# Altium schematic sheet WC_SENS.SchDoc
size A; Organization: Altium Limited; Address1: L3, 12a Rodborough Rd; Address2: Frenchs Forest; Address3: NSW; Address4: Australia 2086; DocumentNumber: 10; SheetNumber: 10; SheetTotal: 11
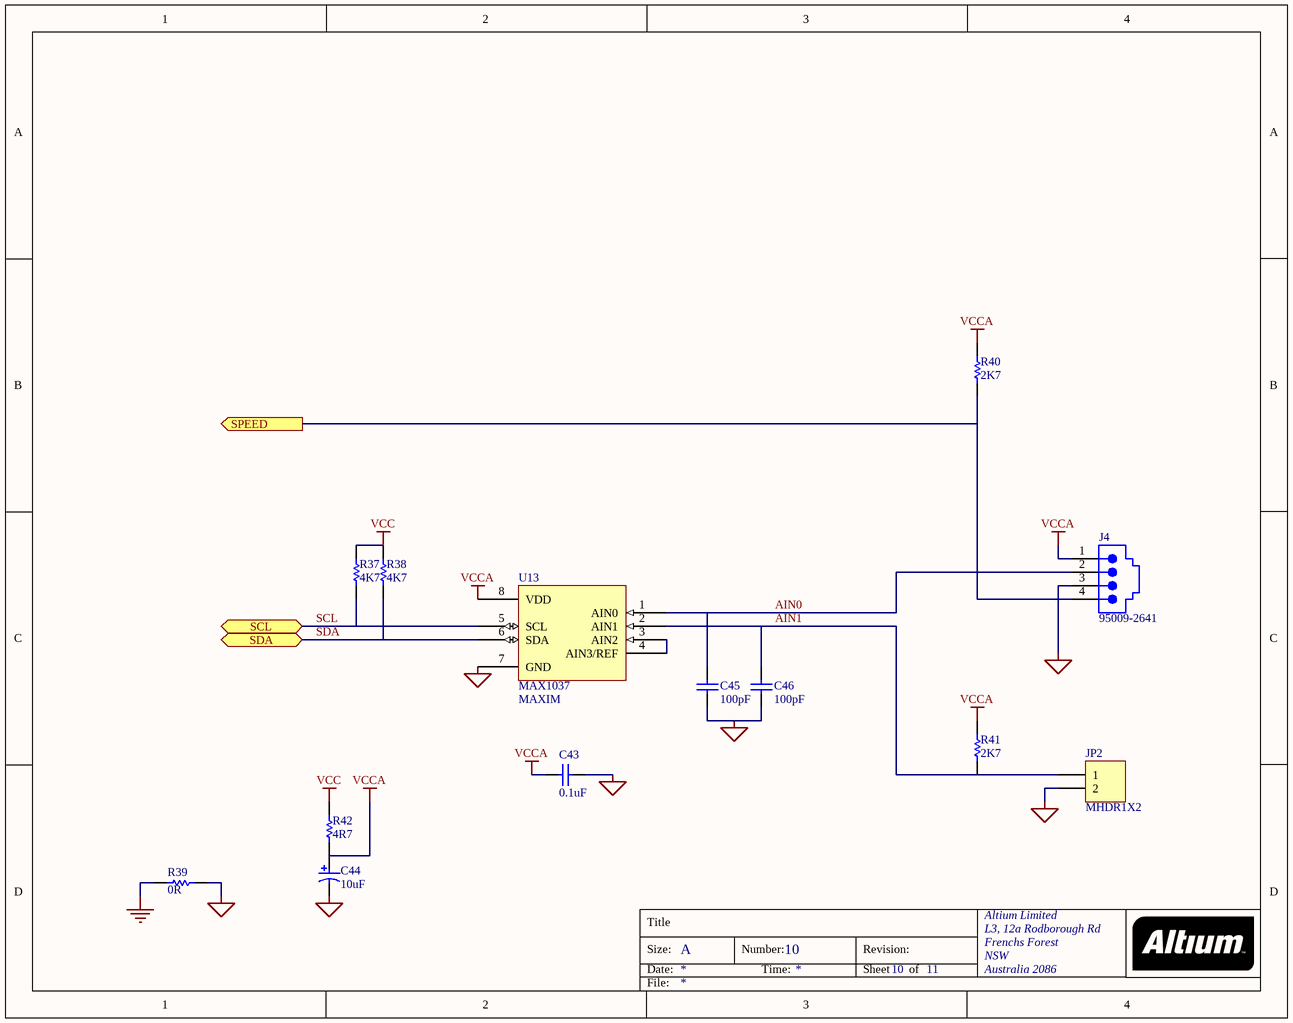
[diagram p0: WC_SENS.SchDoc]

## Parts
C43  0.1uF  [CC2012-0805]
C44  10uF  [MCCT-B]
C45  100pF  [CC2012-0805]
C46  100pF  [CC2012-0805]
J4  95009-2641  [JACK1.27-2H4D]
JP2  MHDR1X2  [TS2.54x2]
R37  4K7  [CC2012-0805]
R38  4K7  [CC2012-0805]
R39  0R  [CC2012-0805]
R40  2K7  [CC2012-0805]
R41  2K7  [CC2012-0805]
R42  4R7  [CC2012-0805]
U13  MAX1037  Supplier: MAXIM  [SOT23_8]

## Ports
SCL (bidir), SDA (bidir), SPEED (out)

## Nets
AGND: C43.2 C44.2 C45.2 C46.2 J4.3 JP2.2 R39.2 U13.7(GND)
GND: R39.1
VCC: R37.1 R38.1 R42.1
VCCA: C43.1 C44.1 J4.1 R40.1 R41.1 R42.2 U13.8(VDD)
AIN0: C45.1 J4.2 U13.1(AIN0)
AIN1: C46.1 JP2.1 R41.2 U13.2(AIN1)
SCL: R37.2 U13.5(SCL) ; port SCL
SDA: R38.2 U13.6(SDA) ; port SDA
SPEED: J4.4 R40.2 ; port SPEED
NetU13_3: U13.3(AIN2) U13.4(AIN3/REF)

## Notes on the sheet
- Title
- Size:
- Date:
- A
- Number:
- Time:
- Revision:
- Sheet
- of
- File:

## Library data of the parts
C43 C45 C46 = CAP: Capacitor
C44 = CAP_POLAR: Polar Capacitor
J4 = 95009-2641: Right Angle, Standard Profile, with Mounting Rib, Flush Mount PCB Jack; Manufacturer: Molex; Package Information: Latest Revision: Dec-2001; Ports: 1; Positions/Loaded: Port1; PCB Mounting: Thru-Hole; Drill Diameter: Nominal, Rounded to nearest 0.05mm; PCB Layout: Complies with Manufacturer's Recommendation.; Published: 25-Jun-2002; Datasheet: Latest Revision: 18-Dec-2001; Package Reference: JACK1.27-2H4D; Publisher: Altium Limited; Category: 3
JP2 = MHDR1X2: Header, 2-Pin; Manufacturer: Generic Components; Class I: Connector; Revision: July-2002: Re-released for DXP Platform.; Publisher: Altium Limited
R37-R42 = RES: Resistor
U13 = MAX1037: 4 Channel 8 Bit ADC, I2C interface, 2.7V to 3.6V Supply